# EAGLE schematic heater_test_1 (EAGLE 7.6.0)
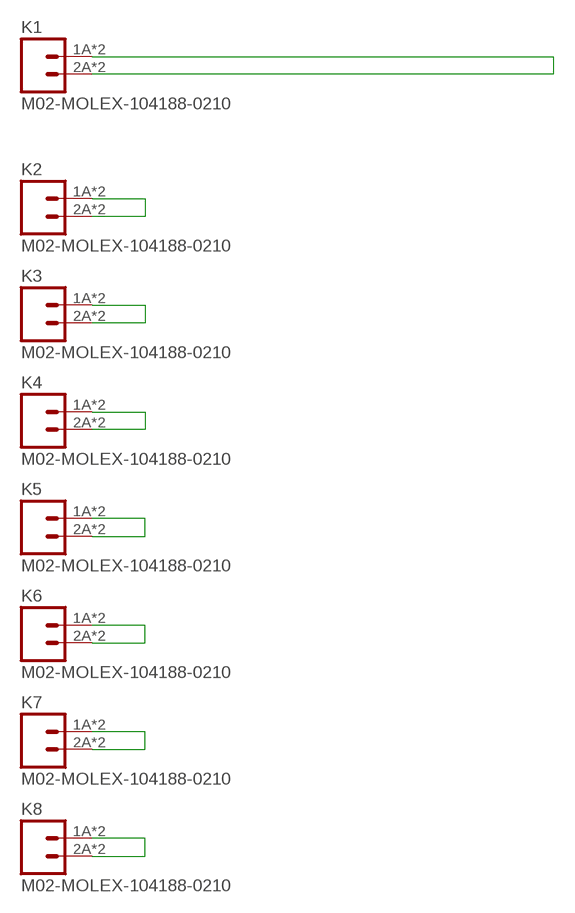
[diagram p0: schematic, sheet 1]

## Parts
K1  M02-MOLEX-104188-0210  [LITE-TRAP-CONNECTOR-2]
K2  M02-MOLEX-104188-0210  [LITE-TRAP-CONNECTOR-2]
K3  M02-MOLEX-104188-0210  [LITE-TRAP-CONNECTOR-2]
K4  M02-MOLEX-104188-0210  [LITE-TRAP-CONNECTOR-2]
K5  M02-MOLEX-104188-0210  [LITE-TRAP-CONNECTOR-2]
K6  M02-MOLEX-104188-0210  [LITE-TRAP-CONNECTOR-2]
K7  M02-MOLEX-104188-0210  [LITE-TRAP-CONNECTOR-2]
K8  M02-MOLEX-104188-0210  [LITE-TRAP-CONNECTOR-2]

## Nets
H_N: K1.1A K1.1B K1.2A K1.2B
N$2: K2.1A K2.1B K2.2A K2.2B
N$3: K3.1A K3.1B K3.2A K3.2B
N$4: K4.1A K4.1B K4.2A K4.2B
N$5: K5.1A K5.1B K5.2A K5.2B
N$6: K6.1A K6.1B K6.2A K6.2B
N$7: K7.1A K7.1B K7.2A K7.2B
N$8: K8.1A K8.1B K8.2A K8.2B

## Library data of the parts
K1-K8 = simbits:M02: Standard 2-pin 0.1" header. Use with - straight break away headers ( PRT-00116) - right angle break away headers (PRT-00553) - swiss pins (PRT-00743) - machine pins (PRT-00117) - female headers (PRT-00115) Molex polarized connector foot print use with: PRT-08233 with associated crimp pins and housings. 2.54_SCREWTERM for use with PRT-10571. 3.5mm Screw Terminal footprints for PRT-08084 5mm Screw Terminal footprints for use with PRT-08432